# Altium schematic sheet Square.SchDoc
size 863 x 558 mm; SheetNumber: 4; SheetTotal: 4
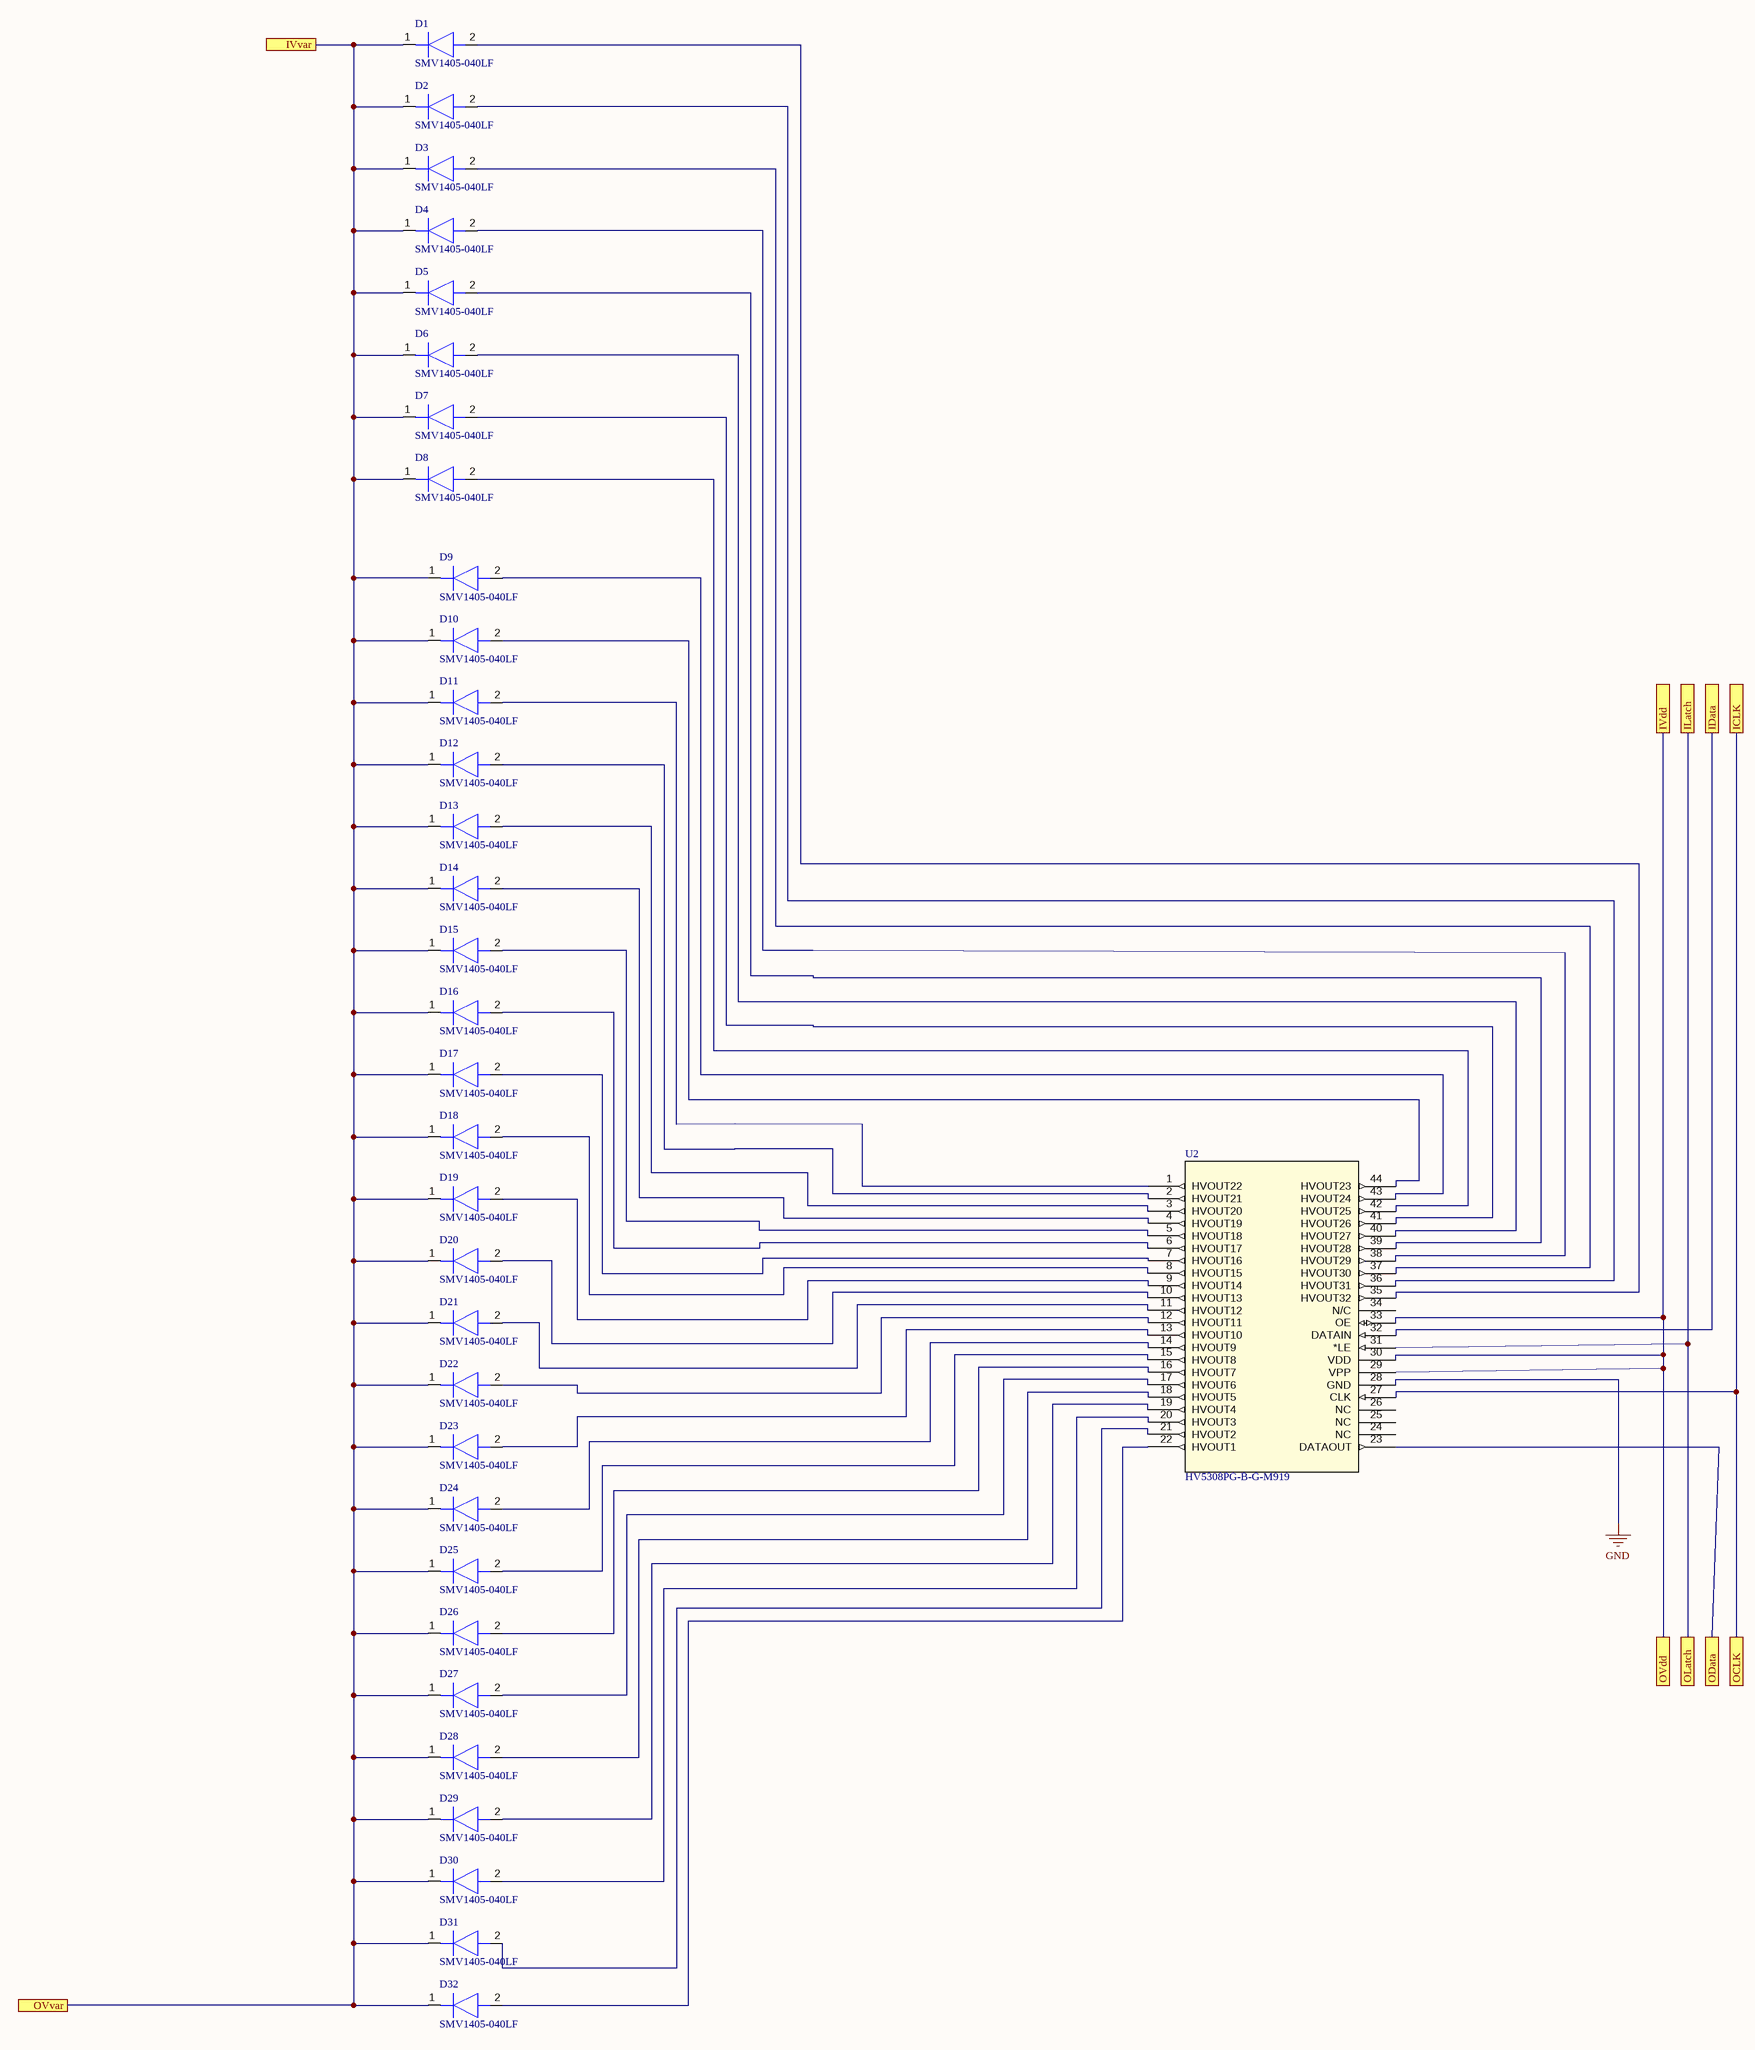
[diagram p0: Square.SchDoc]

## Parts
D1  SMV1405-040LF  [SMV1405040LF]
D2  SMV1405-040LF  [SMV1405040LF]
D3  SMV1405-040LF  [SMV1405040LF]
D4  SMV1405-040LF  [SMV1405040LF]
D5  SMV1405-040LF  [SMV1405040LF]
D6  SMV1405-040LF  [SMV1405040LF]
D7  SMV1405-040LF  [SMV1405040LF]
D8  SMV1405-040LF  [SMV1405040LF]
D9  SMV1405-040LF  [SMV1405040LF]
D10  SMV1405-040LF  [SMV1405040LF]
D11  SMV1405-040LF  [SMV1405040LF]
D12  SMV1405-040LF  [SMV1405040LF]
D13  SMV1405-040LF  [SMV1405040LF]
D14  SMV1405-040LF  [SMV1405040LF]
D15  SMV1405-040LF  [SMV1405040LF]
D16  SMV1405-040LF  [SMV1405040LF]
D17  SMV1405-040LF  [SMV1405040LF]
D18  SMV1405-040LF  [SMV1405040LF]
D19  SMV1405-040LF  [SMV1405040LF]
D20  SMV1405-040LF  [SMV1405040LF]
D21  SMV1405-040LF  [SMV1405040LF]
D22  SMV1405-040LF  [SMV1405040LF]
D23  SMV1405-040LF  [SMV1405040LF]
D24  SMV1405-040LF  [SMV1405040LF]
D25  SMV1405-040LF  [SMV1405040LF]
D26  SMV1405-040LF  [SMV1405040LF]
D27  SMV1405-040LF  [SMV1405040LF]
D28  SMV1405-040LF  [SMV1405040LF]
D29  SMV1405-040LF  [SMV1405040LF]
D30  SMV1405-040LF  [SMV1405040LF]
D31  SMV1405-040LF  [SMV1405040LF]
D32  SMV1405-040LF  [SMV1405040LF]
U2  HV5308PG-B-G-M919  [QFP44_10x10MC_MCH]

## Ports
ICLK, IData, ILatch, IVdd, IVvar, OCLK, OData, OLatch, OVdd, OVvar

## Nets
GND: U2.28(GND)
ICLK: U2.27(CLK) ; port ICLK, port OCLK
IData: U2.32(DATAIN) ; port IData
ILatch: U2.31(*LE) ; port ILatch, port OLatch
IVdd: U2.29(VPP) U2.30(VDD) U2.33(OE) ; port IVdd, port OVdd
IVvar: D1.1(K) D2.1(K) D3.1(K) D4.1(K) D5.1(K) D6.1(K) D7.1(K) D8.1(K) D9.1(K) D10.1(K) D11.1(K) D12.1(K) D13.1(K) D14.1(K) D15.1(K) D16.1(K) D17.1(K) D18.1(K) D19.1(K) D20.1(K) D21.1(K) D22.1(K) D23.1(K) D24.1(K) D25.1(K) D26.1(K) D27.1(K) D28.1(K) D29.1(K) D30.1(K) D31.1(K) D32.1(K) ; port IVvar, port OVvar
OData: U2.23(DATAOUT) ; port OData
NetD1_2: D1.2(A) U2.35(HVOUT32)
NetD2_2: D2.2(A) U2.36(HVOUT31)
NetD3_2: D3.2(A) U2.37(HVOUT30)
NetD4_2: D4.2(A) U2.38(HVOUT29)
NetD5_2: D5.2(A) U2.39(HVOUT28)
NetD6_2: D6.2(A) U2.40(HVOUT27)
NetD7_2: D7.2(A) U2.41(HVOUT26)
NetD8_2: D8.2(A) U2.42(HVOUT25)
NetD9_2: D9.2(A) U2.43(HVOUT24)
NetD10_2: D10.2(A) U2.44(HVOUT23)
NetD11_2: D11.2(A) U2.1(HVOUT22)
NetD12_2: D12.2(A) U2.2(HVOUT21)
NetD13_2: D13.2(A) U2.3(HVOUT20)
NetD14_2: D14.2(A) U2.4(HVOUT19)
NetD15_2: D15.2(A) U2.5(HVOUT18)
NetD16_2: D16.2(A) U2.6(HVOUT17)
NetD17_2: D17.2(A) U2.7(HVOUT16)
NetD18_2: D18.2(A) U2.8(HVOUT15)
NetD19_2: D19.2(A) U2.9(HVOUT14)
NetD20_2: D20.2(A) U2.10(HVOUT13)
NetD21_2: D21.2(A) U2.11(HVOUT12)
NetD22_2: D22.2(A) U2.12(HVOUT11)
NetD23_2: D23.2(A) U2.13(HVOUT10)
NetD24_2: D24.2(A) U2.14(HVOUT9)
NetD25_2: D25.2(A) U2.15(HVOUT8)
NetD26_2: D26.2(A) U2.16(HVOUT7)
NetD27_2: D27.2(A) U2.17(HVOUT6)
NetD28_2: D28.2(A) U2.18(HVOUT5)
NetD29_2: D29.2(A) U2.19(HVOUT4)
NetD30_2: D30.2(A) U2.20(HVOUT3)
NetD31_2: D31.2(A) U2.21(HVOUT2)
NetD32_2: D32.2(A) U2.22(HVOUT1)

Not connected (* = marked no-connect by the designer): U2 24(NC) 25(NC) 26(NC) 34(N/C)

## Notes on the sheet
- DWG. NO.
- REV.
- SHT.
- REVISION
- DESCRIPTION
- DATE
- APPROVED
- THIS DOCUMENT AND THE DATA DISCLOSED HEREIN OR HEREWITH IS THE PROPERTY OF ALTIUM LIMITED AND MAY BE FREELY DISTRIBUTED IN WHOLE. NO RIGHTS ARE RESERVED OR EXPRESS OR IMPLIED WARANTEE GIVEN.
- ENG:
- DSN:
- APPROVALS
- PROJECT
- DOCUMENT REVISION:
- DESIGN ITEM:
- CHK:
- BOM:
- REFERENCE DOCUMENTS
- PROJECT REVISION:
- TITLE
- FAB DWG:
- PCB DWG:
- ASSY DWG:
- SCALE:
- SIZE
- D
- CAGE CODE
- FILE NAME
- DWG NO.
- SHEET
- OF
- REV

## Library data of the parts
D1-D32 = SMV1405-040LF: Diode; Manufacturer_Name: Skyworks; Datasheet Link: https://componentsearchengine.com/Datasheets/1/SMV1405-040LF.pdf; Height: 0.5mm; Manufacturer_Part_Number: SMV1405-040LF; Mouser Part Number: 873-SMV1405-040LF; Mouser Price/Stock: https://www.mouser.co.uk/ProductDetail/Skyworks-Solutions-Inc/SMV1405-040LF?qs=WMHGlxXAKT83CwR50Zj5aw%3D%3D
U2 = HV5308PG-B-G-M919: No Description Available; Mfr_Name: Microchip; Copyright: Copyright (C) 2022 Ultra Librarian. All rights reserved.; Manufacturer_Part_Number: HV5308PG-B-G-M919; RefDes: RefDes; Type: DEV